# Altium schematic sheet NRF.SchDoc
size A
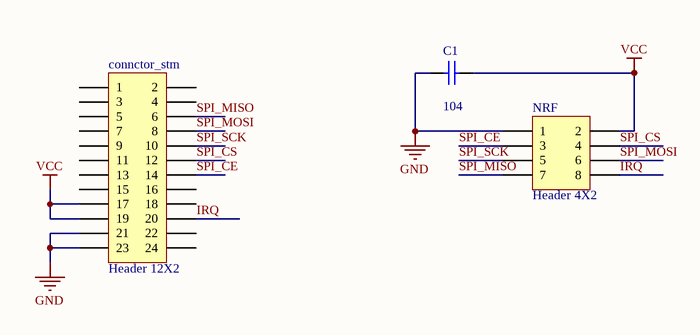
[diagram p0: NRF.SchDoc]

## Parts
C1  value 104  [C1206]
connctor_stm  Header 12X2  [HDR2X12]
NRF  Header 4X2  [HDR2X4]

## Nets
GND: C1.1 connctor_stm.21 connctor_stm.23 NRF.1
VCC: C1.2 connctor_stm.17 connctor_stm.19 NRF.2
IRQ: connctor_stm.20 NRF.8
SPI_CE: connctor_stm.14 NRF.3
SPI_CS: connctor_stm.12 NRF.4
SPI_MISO: connctor_stm.6 NRF.7
SPI_MOSI: connctor_stm.8 NRF.6
SPI_SCK: connctor_stm.10 NRF.5

Not connected (* = marked no-connect by the designer): connctor_stm 1 2 3 4 5 7 9 11 13 15 16 18 22 24

## Library data of the parts
C1 = Cap Semi: Capacitor (Semiconductor SIM Model); Published: 8-Jun-2000; LatestRevisionDate: 29-May-2009; LatestRevisionNote: IPC-7351 Footprint Added.; PackageReference: C1206; Publisher: Altium Limited; PackageDescription: Chip Capacitor
connctor_stm = Header 12X2: Header, 12-Pin, Dual row; LatestRevisionDate: 17-Jul-2002; LatestRevisionNote: Re-released for DXP Platform.; Publisher: Altium Limited
NRF = Header 4X2: Header, 4-Pin, Dual row; LatestRevisionDate: 17-Jul-2002; LatestRevisionNote: Re-released for DXP Platform.; Publisher: Altium Limited